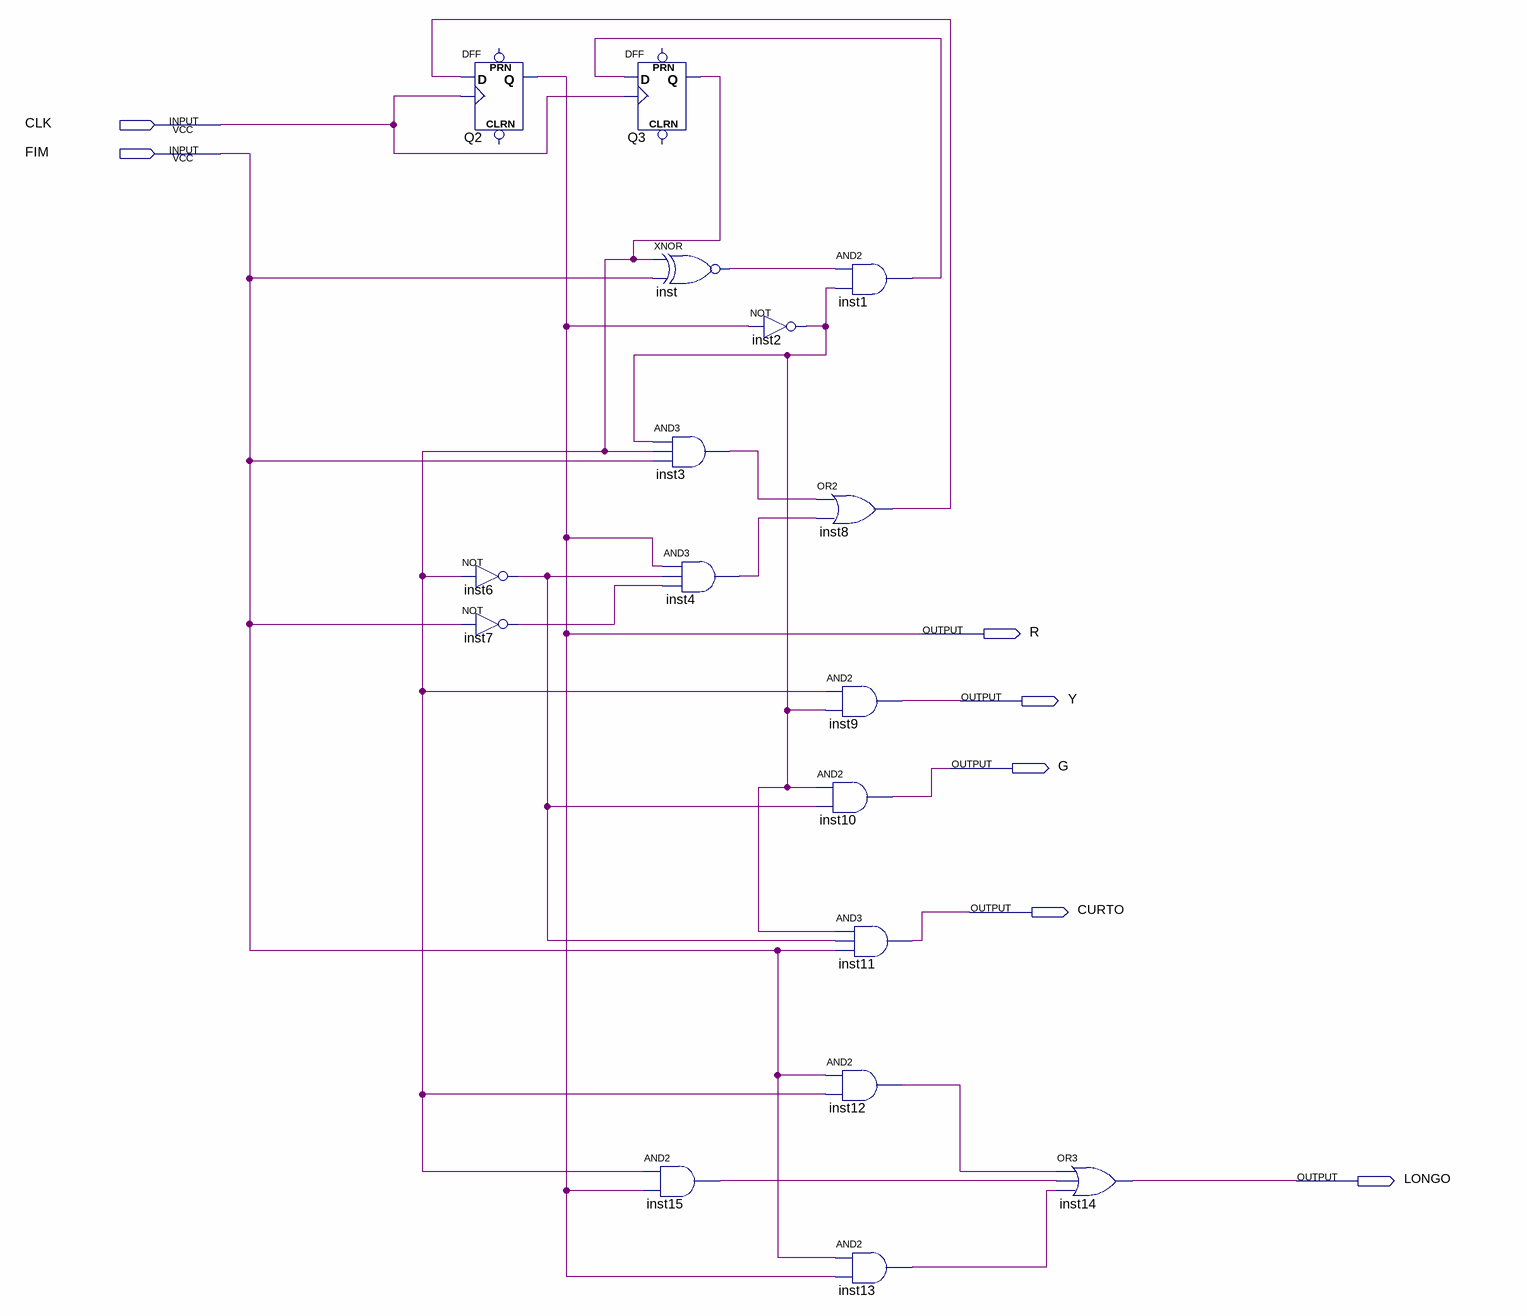
[diagram p0: schematic sheet]
// Quartus schematic Exercicio_2_Semaforo.bdf as structural Verilog: 17 symbols, 7 pins
module Exercicio_2_Semaforo (
  input  CLK,
  input  FIM,
  output R,
  output Y,
  output G,
  output CURTO,
  output LONGO
);

  wire inst1_out, inst2_out, inst3_out, inst4_out, inst6_out, inst7_out, inst8_out, inst12_out, inst13_out,
       inst15_out, inst_out, Q3_q;

  DFF Q2 (.CLK(CLK), .D(inst8_out), .Q(R));  // open: CLRN, PRN
  not inst6 (inst6_out, Q3_q);
  not inst7 (inst7_out, FIM);
  DFF Q3 (.CLK(CLK), .D(inst1_out), .Q(Q3_q));  // open: CLRN, PRN
  xnor inst (inst_out, Q3_q, FIM);
  and inst3 (inst3_out, inst2_out, Q3_q, FIM);
  and inst4 (inst4_out, R, inst6_out, inst7_out);
  and inst15 (inst15_out, Q3_q, R);
  not inst2 (inst2_out, R);
  and inst1 (inst1_out, inst_out, inst2_out);
  or inst8 (inst8_out, inst3_out, inst4_out);
  and inst9 (Y, Q3_q, inst2_out);
  and inst10 (G, inst2_out, inst6_out);
  and inst11 (CURTO, inst2_out, inst6_out, FIM);
  and inst12 (inst12_out, FIM, Q3_q);
  and inst13 (inst13_out, FIM, R);
  or inst14 (LONGO, inst12_out, inst15_out, inst13_out);
endmodule
